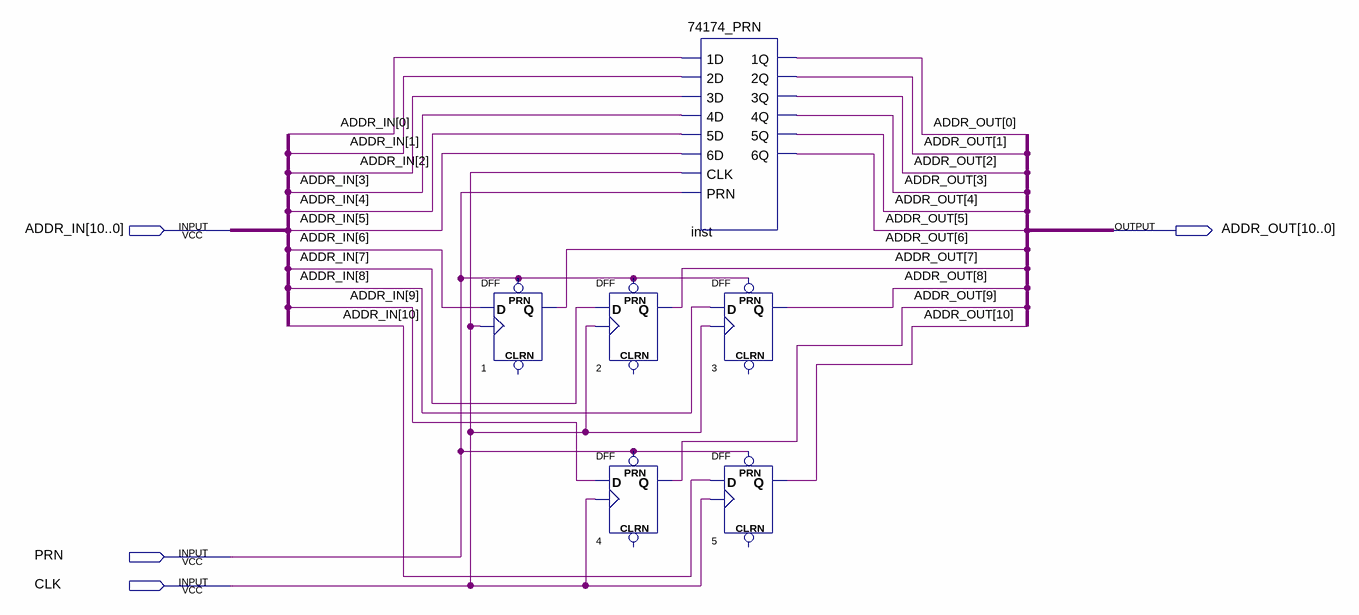
[diagram p0: schematic sheet]
// Quartus schematic Latch11b.bdf as structural Verilog: 6 symbols, 4 pins
module Latch11b (
  input  [10:0] ADDR_IN,
  input  PRN,
  input  CLK,
  output [10:0] ADDR_OUT
);

  DFF u_1 (.CLK(CLK), .D(ADDR_IN[6]), .PRN(PRN), .Q(ADDR_OUT[6]));  // open: CLRN
  DFF u_2 (.CLK(CLK), .D(ADDR_IN[7]), .PRN(PRN), .Q(ADDR_OUT[7]));  // open: CLRN
  DFF u_4 (.CLK(CLK), .D(ADDR_IN[9]), .PRN(PRN), .Q(ADDR_OUT[9]));  // open: CLRN
  \74174_PRN  inst (
    .\1D (ADDR_IN[0]), .\2D (ADDR_IN[1]), .\3D (ADDR_IN[2]), .\4D (ADDR_IN[3]), .\5D (ADDR_IN[4]),
    .\6D (ADDR_IN[5]), .CLK(CLK), .PRN(PRN), .\1Q (ADDR_OUT[0]), .\2Q (ADDR_OUT[1]), .\3Q (ADDR_OUT[2]),
    .\4Q (ADDR_OUT[3]), .\5Q (ADDR_OUT[4]), .\6Q (ADDR_OUT[5]));
  DFF u_3 (.CLK(CLK), .D(ADDR_IN[8]), .PRN(PRN), .Q(ADDR_OUT[8]));  // open: CLRN
  DFF u_5 (.CLK(CLK), .D(ADDR_IN[10]), .PRN(PRN), .Q(ADDR_OUT[10]));  // open: CLRN
endmodule
